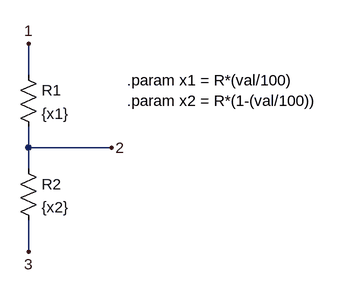
[diagram p0: schematic pot.asc]
pot.asc, the LTspice schematic file:
Version 4
SHEET 1 880 680
WIRE 208 80 208 32
WIRE 208 192 208 160
WIRE 336 192 208 192
WIRE 208 224 208 192
WIRE 208 352 208 304
FLAG 208 32 1
FLAG 336 192 2
FLAG 208 352 3
SYMBOL res 192 64 R0
SYMATTR InstName R1
SYMATTR Value {x1}
SYMBOL res 192 208 R0
SYMATTR InstName R2
SYMATTR Value {x2}
TEXT 360 88 Left 2 !.param x1 = R*(val/100)
TEXT 360 120 Left 2 !.param x2 = R*(1-(val/100))

The netlist it stands for:
* pot.asc
R1 1 2 {x1}
R2 2 3 {x2}
.param x1 = R*(val/100)
.param x2 = R*(1-(val/100))
.backanno
.end